# Altium schematic sheet SoC_pwr_1.SchDoc
size A1; PageSetup: Record=PageOptions|CenterHorizontal=True|CenterVertical=True|PrintScale=0.50|XCorrection=1.00|YCorrection=1.00|PrintKind=1|BorderSize=5000000|LeftOffset=0|BottomOffset=0|Orientation=2|PaperLength=1000|PaperWidth=1000|Scale=100|PaperSource=7|PrintQuality=-3|MediaType=1|DitherType=10|PrintScaleMode=1|PaperKind=A3|PaperIndex=8
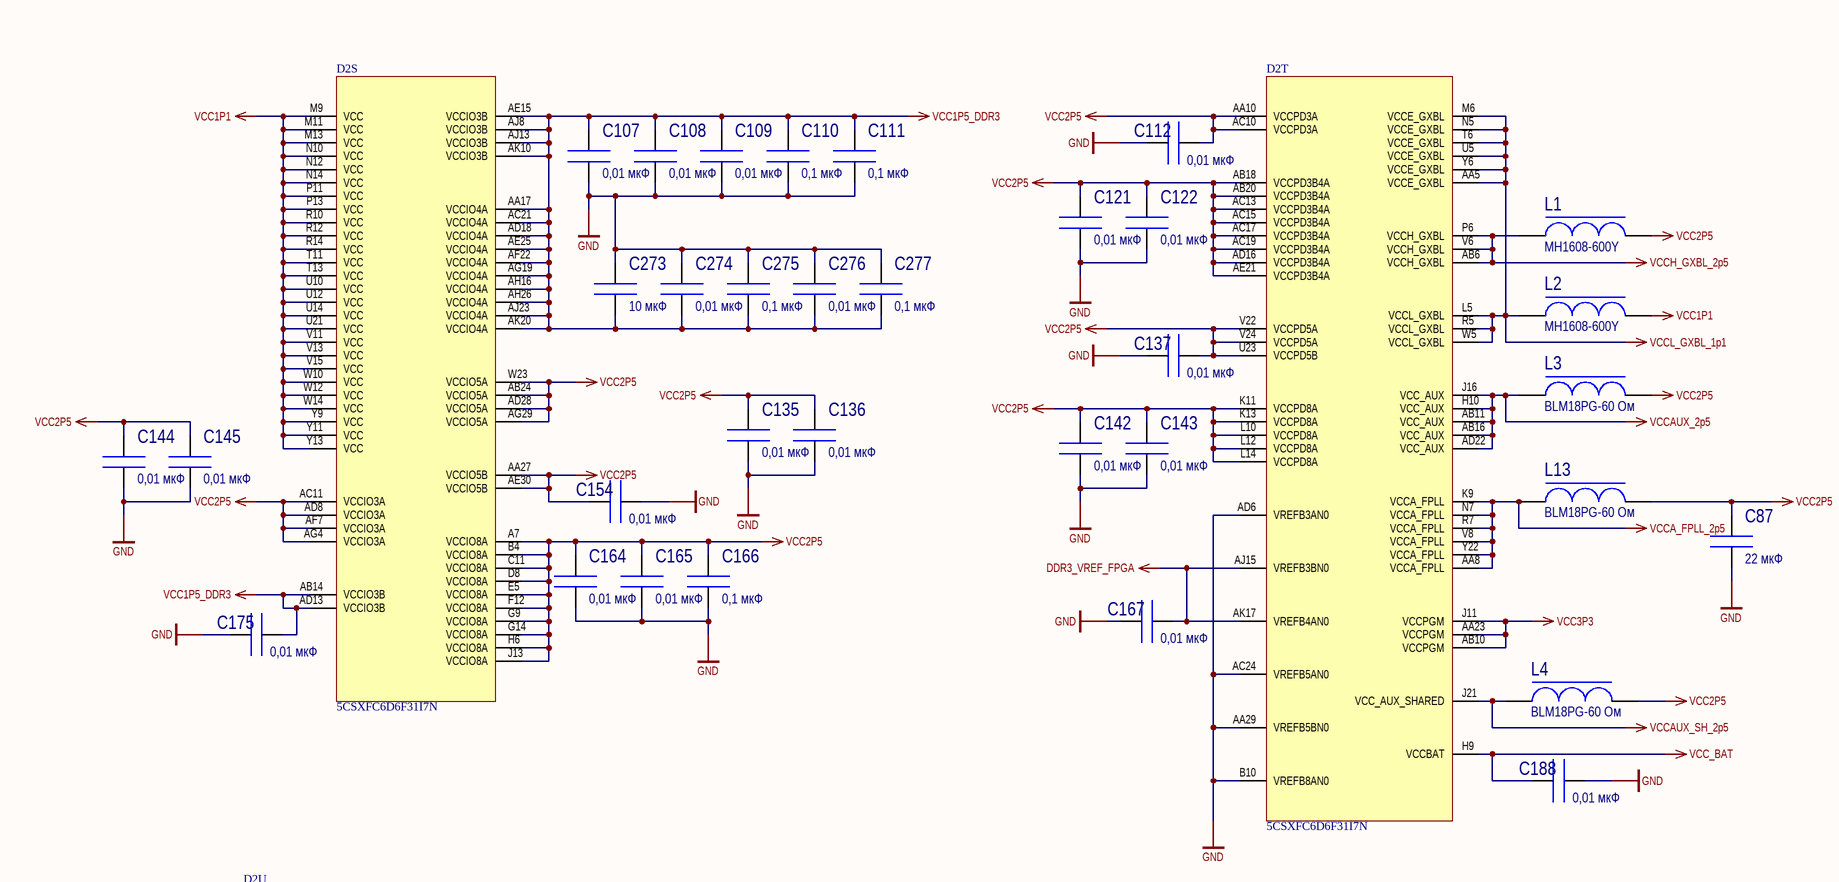
[diagram p0: SoC_pwr_1.SchDoc, top left]
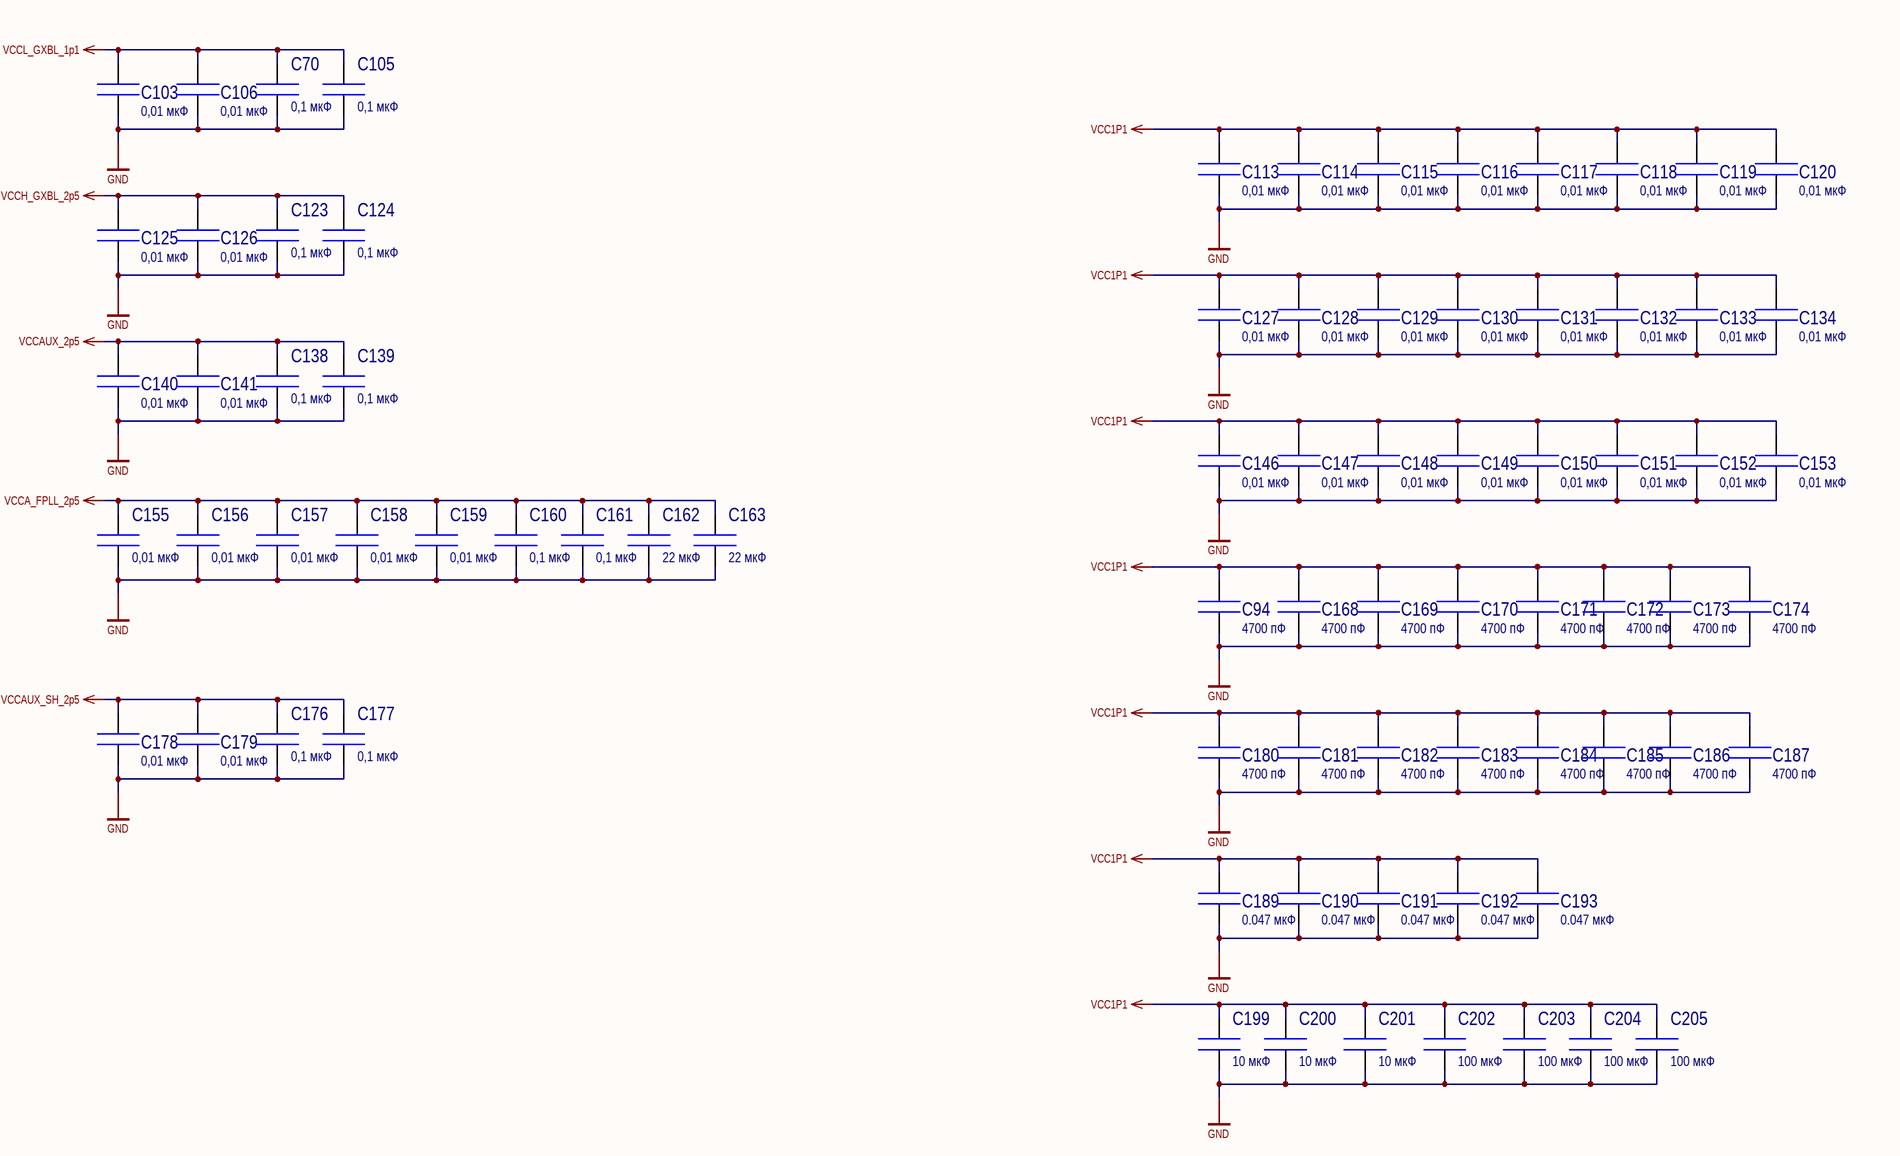
[diagram p1: SoC_pwr_1.SchDoc, top right]
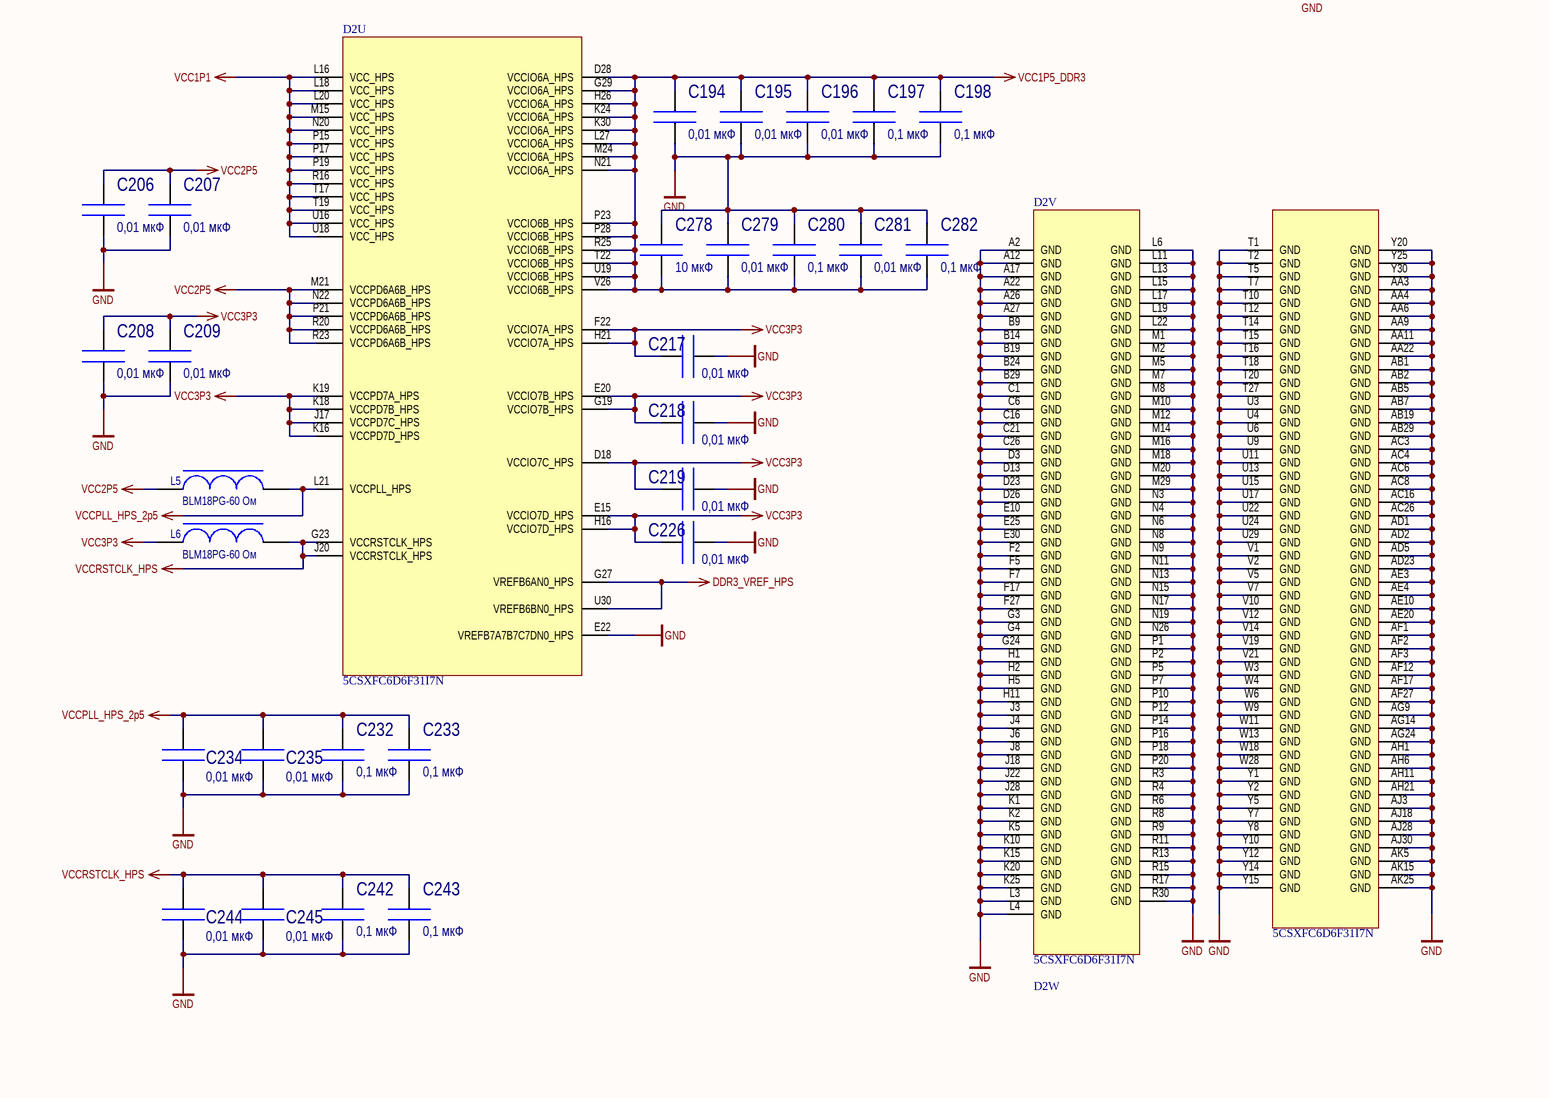
[diagram p2: SoC_pwr_1.SchDoc, bottom left]
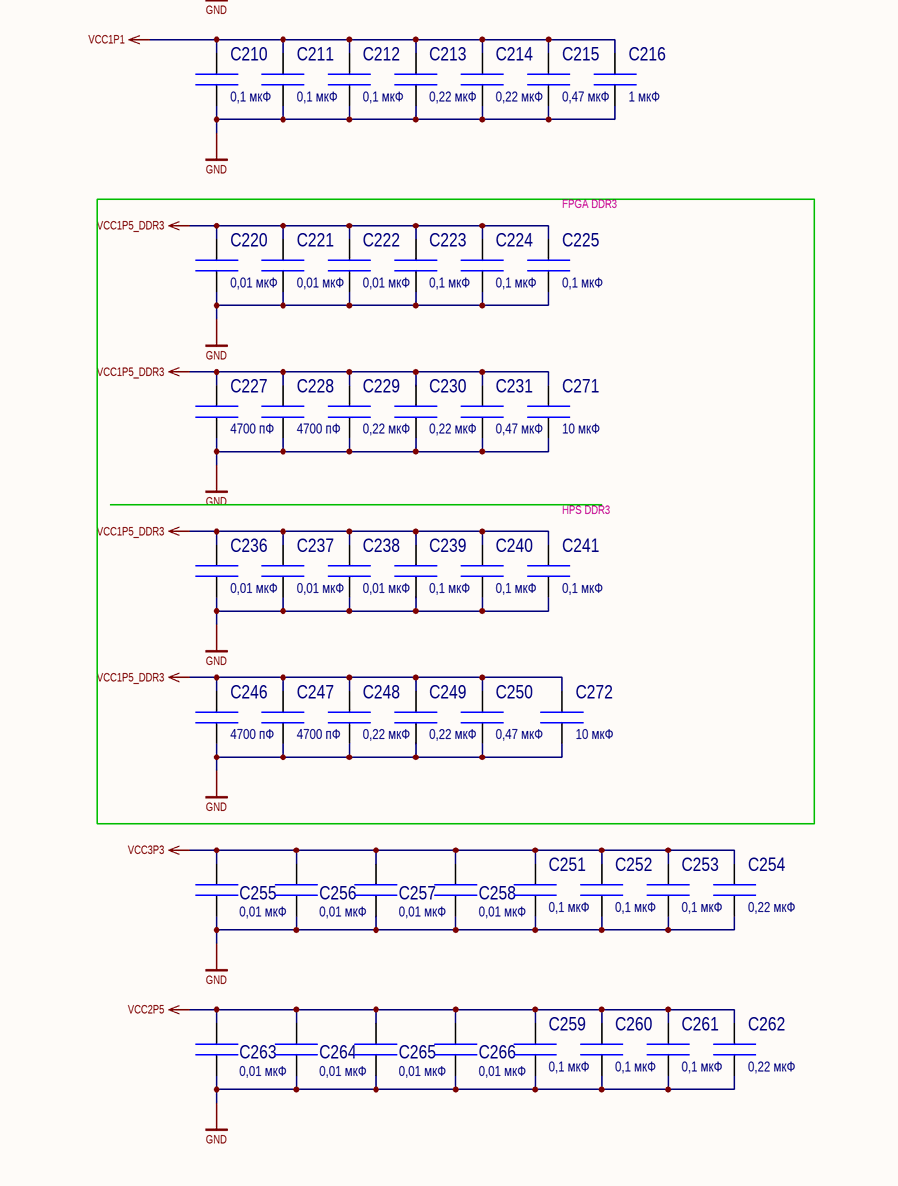
[diagram p3: SoC_pwr_1.SchDoc, bottom right]

## Parts
C70  value 0,1 мкФ  [CC0402(1005)]  (hidden comment: CC0402-X7R-0,1 мкФ-20%-10В)
C87  value 22 мкФ  [CC0603]  (hidden comment: CC0603-X5R-22 мкФ-20%-6,3В)
C94  value 4700 пФ  [CC0402(1005)]  (hidden comment: CC0402-X7R-4700 пФ-10%-50В)
C103  value 0,01 мкФ  [CC0402(1005)]  (hidden comment: CC0402-X7R-0,01 мкФ-10%-50В)
C105  value 0,1 мкФ  [CC0402(1005)]  (hidden comment: CC0402-X7R-0,1 мкФ-20%-10В)
C106  value 0,01 мкФ  [CC0402(1005)]  (hidden comment: CC0402-X7R-0,01 мкФ-10%-50В)
C107  value 0,01 мкФ  [CC0402(1005)]  (hidden comment: CC0402-X7R-0,01 мкФ-10%-50В)
C108  value 0,01 мкФ  [CC0402(1005)]  (hidden comment: CC0402-X7R-0,01 мкФ-10%-50В)
C109  value 0,01 мкФ  [CC0402(1005)]  (hidden comment: CC0402-X7R-0,01 мкФ-10%-50В)
C110  value 0,1 мкФ  [CC0402(1005)]  (hidden comment: CC0402-X7R-0,1 мкФ-20%-10В)
C111  value 0,1 мкФ  [CC0402(1005)]  (hidden comment: CC0402-X7R-0,1 мкФ-20%-10В)
C112  value 0,01 мкФ  [CC0402(1005)]  (hidden comment: CC0402-X7R-0,01 мкФ-10%-50В)
C113  value 0,01 мкФ  [CC0402(1005)]  (hidden comment: CC0402-X7R-0,01 мкФ-10%-50В)
C114  value 0,01 мкФ  [CC0402(1005)]  (hidden comment: CC0402-X7R-0,01 мкФ-10%-50В)
C115  value 0,01 мкФ  [CC0402(1005)]  (hidden comment: CC0402-X7R-0,01 мкФ-10%-50В)
C116  value 0,01 мкФ  [CC0402(1005)]  (hidden comment: CC0402-X7R-0,01 мкФ-10%-50В)
C117  value 0,01 мкФ  [CC0402(1005)]  (hidden comment: CC0402-X7R-0,01 мкФ-10%-50В)
C118  value 0,01 мкФ  [CC0402(1005)]  (hidden comment: CC0402-X7R-0,01 мкФ-10%-50В)
C119  value 0,01 мкФ  [CC0402(1005)]  (hidden comment: CC0402-X7R-0,01 мкФ-10%-50В)
C120  value 0,01 мкФ  [CC0402(1005)]  (hidden comment: CC0402-X7R-0,01 мкФ-10%-50В)
C121  value 0,01 мкФ  [CC0402(1005)]  (hidden comment: CC0402-X7R-0,01 мкФ-10%-50В)
C122  value 0,01 мкФ  [CC0402(1005)]  (hidden comment: CC0402-X7R-0,01 мкФ-10%-50В)
C123  value 0,1 мкФ  [CC0402(1005)]  (hidden comment: CC0402-X7R-0,1 мкФ-20%-10В)
C124  value 0,1 мкФ  [CC0402(1005)]  (hidden comment: CC0402-X7R-0,1 мкФ-20%-10В)
C125  value 0,01 мкФ  [CC0402(1005)]  (hidden comment: CC0402-X7R-0,01 мкФ-10%-50В)
C126  value 0,01 мкФ  [CC0402(1005)]  (hidden comment: CC0402-X7R-0,01 мкФ-10%-50В)
C127  value 0,01 мкФ  [CC0402(1005)]  (hidden comment: CC0402-X7R-0,01 мкФ-10%-50В)
C128  value 0,01 мкФ  [CC0402(1005)]  (hidden comment: CC0402-X7R-0,01 мкФ-10%-50В)
C129  value 0,01 мкФ  [CC0402(1005)]  (hidden comment: CC0402-X7R-0,01 мкФ-10%-50В)
C130  value 0,01 мкФ  [CC0402(1005)]  (hidden comment: CC0402-X7R-0,01 мкФ-10%-50В)
C131  value 0,01 мкФ  [CC0402(1005)]  (hidden comment: CC0402-X7R-0,01 мкФ-10%-50В)
C132  value 0,01 мкФ  [CC0402(1005)]  (hidden comment: CC0402-X7R-0,01 мкФ-10%-50В)
C133  value 0,01 мкФ  [CC0402(1005)]  (hidden comment: CC0402-X7R-0,01 мкФ-10%-50В)
C134  value 0,01 мкФ  [CC0402(1005)]  (hidden comment: CC0402-X7R-0,01 мкФ-10%-50В)
C135  value 0,01 мкФ  [CC0402(1005)]  (hidden comment: CC0402-X7R-0,01 мкФ-10%-50В)
C136  value 0,01 мкФ  [CC0402(1005)]  (hidden comment: CC0402-X7R-0,01 мкФ-10%-50В)
C137  value 0,01 мкФ  [CC0402(1005)]  (hidden comment: CC0402-X7R-0,01 мкФ-10%-50В)
C138  value 0,1 мкФ  [CC0402(1005)]  (hidden comment: CC0402-X7R-0,1 мкФ-20%-10В)
C139  value 0,1 мкФ  [CC0402(1005)]  (hidden comment: CC0402-X7R-0,1 мкФ-20%-10В)
C140  value 0,01 мкФ  [CC0402(1005)]  (hidden comment: CC0402-X7R-0,01 мкФ-10%-50В)
C141  value 0,01 мкФ  [CC0402(1005)]  (hidden comment: CC0402-X7R-0,01 мкФ-10%-50В)
C142  value 0,01 мкФ  [CC0402(1005)]  (hidden comment: CC0402-X7R-0,01 мкФ-10%-50В)
C143  value 0,01 мкФ  [CC0402(1005)]  (hidden comment: CC0402-X7R-0,01 мкФ-10%-50В)
C144  value 0,01 мкФ  [CC0402(1005)]  (hidden comment: CC0402-X7R-0,01 мкФ-10%-50В)
C145  value 0,01 мкФ  [CC0402(1005)]  (hidden comment: CC0402-X7R-0,01 мкФ-10%-50В)
C146  value 0,01 мкФ  [CC0402(1005)]  (hidden comment: CC0402-X7R-0,01 мкФ-10%-50В)
C147  value 0,01 мкФ  [CC0402(1005)]  (hidden comment: CC0402-X7R-0,01 мкФ-10%-50В)
C148  value 0,01 мкФ  [CC0402(1005)]  (hidden comment: CC0402-X7R-0,01 мкФ-10%-50В)
C149  value 0,01 мкФ  [CC0402(1005)]  (hidden comment: CC0402-X7R-0,01 мкФ-10%-50В)
C150  value 0,01 мкФ  [CC0402(1005)]  (hidden comment: CC0402-X7R-0,01 мкФ-10%-50В)
C151  value 0,01 мкФ  [CC0402(1005)]  (hidden comment: CC0402-X7R-0,01 мкФ-10%-50В)
C152  value 0,01 мкФ  [CC0402(1005)]  (hidden comment: CC0402-X7R-0,01 мкФ-10%-50В)
C153  value 0,01 мкФ  [CC0402(1005)]  (hidden comment: CC0402-X7R-0,01 мкФ-10%-50В)
C154  value 0,01 мкФ  [CC0402(1005)]  (hidden comment: CC0402-X7R-0,01 мкФ-10%-50В)
C155  value 0,01 мкФ  [CC0402(1005)]  (hidden comment: CC0402-X7R-0,01 мкФ-10%-50В)
C156  value 0,01 мкФ  [CC0402(1005)]  (hidden comment: CC0402-X7R-0,01 мкФ-10%-50В)
C157  value 0,01 мкФ  [CC0402(1005)]  (hidden comment: CC0402-X7R-0,01 мкФ-10%-50В)
C158  value 0,01 мкФ  [CC0402(1005)]  (hidden comment: CC0402-X7R-0,01 мкФ-10%-50В)
C159  value 0,01 мкФ  [CC0402(1005)]  (hidden comment: CC0402-X7R-0,01 мкФ-10%-50В)
C160  value 0,1 мкФ  [CC0402(1005)]  (hidden comment: CC0402-X7R-0,1 мкФ-20%-10В)
C161  value 0,1 мкФ  [CC0402(1005)]  (hidden comment: CC0402-X7R-0,1 мкФ-20%-10В)
C162  value 22 мкФ  [CC0603]  (hidden comment: CC0603-X5R-22 мкФ-20%-6,3В)
C163  value 22 мкФ  [CC0603]  (hidden comment: CC0603-X5R-22 мкФ-20%-6,3В)
C164  value 0,01 мкФ  [CC0402(1005)]  (hidden comment: CC0402-X7R-0,01 мкФ-10%-50В)
C165  value 0,01 мкФ  [CC0402(1005)]  (hidden comment: CC0402-X7R-0,01 мкФ-10%-50В)
C166  value 0,1 мкФ  [CC0402(1005)]  (hidden comment: CC0402-X7R-0,1 мкФ-20%-10В)
C167  value 0,01 мкФ  [CC0402(1005)]  (hidden comment: CC0402-X7R-0,01 мкФ-10%-50В)
C168  value 4700 пФ  [CC0402(1005)]  (hidden comment: CC0402-X7R-4700 пФ-10%-50В)
C169  value 4700 пФ  [CC0402(1005)]  (hidden comment: CC0402-X7R-4700 пФ-10%-50В)
C170  value 4700 пФ  [CC0402(1005)]  (hidden comment: CC0402-X7R-4700 пФ-10%-50В)
C171  value 4700 пФ  [CC0402(1005)]  (hidden comment: CC0402-X7R-4700 пФ-10%-50В)
C172  value 4700 пФ  [CC0402(1005)]  (hidden comment: CC0402-X7R-4700 пФ-10%-50В)
C173  value 4700 пФ  [CC0402(1005)]  (hidden comment: CC0402-X7R-4700 пФ-10%-50В)
C174  value 4700 пФ  [CC0402(1005)]  (hidden comment: CC0402-X7R-4700 пФ-10%-50В)
C175  value 0,01 мкФ  [CC0402(1005)]  (hidden comment: CC0402-X7R-0,01 мкФ-10%-50В)
C176  value 0,1 мкФ  [CC0402(1005)]  (hidden comment: CC0402-X7R-0,1 мкФ-20%-10В)
C177  value 0,1 мкФ  [CC0402(1005)]  (hidden comment: CC0402-X7R-0,1 мкФ-20%-10В)
C178  value 0,01 мкФ  [CC0402(1005)]  (hidden comment: CC0402-X7R-0,01 мкФ-10%-50В)
C179  value 0,01 мкФ  [CC0402(1005)]  (hidden comment: CC0402-X7R-0,01 мкФ-10%-50В)
C180  value 4700 пФ  [CC0402(1005)]  (hidden comment: CC0402-X7R-4700 пФ-10%-50В)
C181  value 4700 пФ  [CC0402(1005)]  (hidden comment: CC0402-X7R-4700 пФ-10%-50В)
C182  value 4700 пФ  [CC0402(1005)]  (hidden comment: CC0402-X7R-4700 пФ-10%-50В)
C183  value 4700 пФ  [CC0402(1005)]  (hidden comment: CC0402-X7R-4700 пФ-10%-50В)
C184  value 4700 пФ  [CC0402(1005)]  (hidden comment: CC0402-X7R-4700 пФ-10%-50В)
C185  value 4700 пФ  [CC0402(1005)]  (hidden comment: CC0402-X7R-4700 пФ-10%-50В)
C186  value 4700 пФ  [CC0402(1005)]  (hidden comment: CC0402-X7R-4700 пФ-10%-50В)
C187  value 4700 пФ  [CC0402(1005)]  (hidden comment: CC0402-X7R-4700 пФ-10%-50В)
C188  value 0,01 мкФ  [CC0402(1005)]  (hidden comment: CC0402-X7R-0,01 мкФ-10%-50В)
C189  value 0.047 мкФ  [CC0402(1005)]  (hidden comment: CC0402-X7R-0.047 мкФ-10%-50В)
C190  value 0.047 мкФ  [CC0402(1005)]  (hidden comment: CC0402-X7R-0.047 мкФ-10%-50В)
C191  value 0.047 мкФ  [CC0402(1005)]  (hidden comment: CC0402-X7R-0.047 мкФ-10%-50В)
C192  value 0.047 мкФ  [CC0402(1005)]  (hidden comment: CC0402-X7R-0.047 мкФ-10%-50В)
C193  value 0.047 мкФ  [CC0402(1005)]  (hidden comment: CC0402-X7R-0.047 мкФ-10%-50В)
C194  value 0,01 мкФ  [CC0402(1005)]  (hidden comment: CC0402-X7R-0,01 мкФ-10%-50В)
C195  value 0,01 мкФ  [CC0402(1005)]  (hidden comment: CC0402-X7R-0,01 мкФ-10%-50В)
C196  value 0,01 мкФ  [CC0402(1005)]  (hidden comment: CC0402-X7R-0,01 мкФ-10%-50В)
C197  value 0,1 мкФ  [CC0402(1005)]  (hidden comment: CC0402-X7R-0,1 мкФ-20%-10В)
C198  value 0,1 мкФ  [CC0402(1005)]  (hidden comment: CC0402-X7R-0,1 мкФ-20%-10В)
C199  value 10 мкФ  [CC0402(1005)]  (hidden comment: CC0402-X5R-10 мкФ-20%-6.3В)
C200  value 10 мкФ  [CC0402(1005)]  (hidden comment: CC0402-X5R-10 мкФ-20%-6.3В)
C201  value 10 мкФ  [CC0402(1005)]  (hidden comment: CC0402-X5R-10 мкФ-20%-6.3В)
C202  value 100 мкФ  [CC0805]  (hidden comment: CC0805-X5R-100 мкФ-20%-4В)
C203  value 100 мкФ  [CC0805]  (hidden comment: CC0805-X5R-100 мкФ-20%-4В)
C204  value 100 мкФ  [CC0805]  (hidden comment: CC0805-X5R-100 мкФ-20%-4В)
C205  value 100 мкФ  [CC0805]  (hidden comment: CC0805-X5R-100 мкФ-20%-4В)
C206  value 0,01 мкФ  [CC0402(1005)]  (hidden comment: CC0402-X7R-0,01 мкФ-10%-50В)
C207  value 0,01 мкФ  [CC0402(1005)]  (hidden comment: CC0402-X7R-0,01 мкФ-10%-50В)
C208  value 0,01 мкФ  [CC0402(1005)]  (hidden comment: CC0402-X7R-0,01 мкФ-10%-50В)
C209  value 0,01 мкФ  [CC0402(1005)]  (hidden comment: CC0402-X7R-0,01 мкФ-10%-50В)
C210  value 0,1 мкФ  [CC0402(1005)]  (hidden comment: CC0402-X7R-0,1 мкФ-20%-10В)
C211  value 0,1 мкФ  [CC0402(1005)]  (hidden comment: CC0402-X7R-0,1 мкФ-20%-10В)
C212  value 0,1 мкФ  [CC0402(1005)]  (hidden comment: CC0402-X7R-0,1 мкФ-20%-10В)
C213  value 0,22 мкФ  [CC0402(1005)]  (hidden comment: CC0402-X7R-0,22 мкФ-10%-6.3В)
C214  value 0,22 мкФ  [CC0402(1005)]  (hidden comment: CC0402-X7R-0,22 мкФ-10%-6.3В)
C215  value 0,47 мкФ  [CC0402(1005)]  (hidden comment: CC0402-X7R-0,47 мкФ-10%-6.3В)
C216  value 1 мкФ  [CC0402(1005)]  (hidden comment: CC0402-X5R-1 мкФ-10%-6.3В)
C217  value 0,01 мкФ  [CC0402(1005)]  (hidden comment: CC0402-X7R-0,01 мкФ-10%-50В)
C218  value 0,01 мкФ  [CC0402(1005)]  (hidden comment: CC0402-X7R-0,01 мкФ-10%-50В)
C219  value 0,01 мкФ  [CC0402(1005)]  (hidden comment: CC0402-X7R-0,01 мкФ-10%-50В)
C220  value 0,01 мкФ  [CC0402(1005)]  (hidden comment: CC0402-X7R-0,01 мкФ-10%-50В)
C221  value 0,01 мкФ  [CC0402(1005)]  (hidden comment: CC0402-X7R-0,01 мкФ-10%-50В)
C222  value 0,01 мкФ  [CC0402(1005)]  (hidden comment: CC0402-X7R-0,01 мкФ-10%-50В)
C223  value 0,1 мкФ  [CC0402(1005)]  (hidden comment: CC0402-X7R-0,1 мкФ-20%-10В)
C224  value 0,1 мкФ  [CC0402(1005)]  (hidden comment: CC0402-X7R-0,1 мкФ-20%-10В)
C225  value 0,1 мкФ  [CC0402(1005)]  (hidden comment: CC0402-X7R-0,1 мкФ-20%-10В)
C226  value 0,01 мкФ  [CC0402(1005)]  (hidden comment: CC0402-X7R-0,01 мкФ-10%-50В)
C227  value 4700 пФ  [CC0402(1005)]  (hidden comment: CC0402-X7R-4700 пФ-10%-50В)
C228  value 4700 пФ  [CC0402(1005)]  (hidden comment: CC0402-X7R-4700 пФ-10%-50В)
C229  value 0,22 мкФ  [CC0402(1005)]  (hidden comment: CC0402-X7R-0,22 мкФ-10%-6.3В)
C230  value 0,22 мкФ  [CC0402(1005)]  (hidden comment: CC0402-X7R-0,22 мкФ-10%-6.3В)
C231  value 0,47 мкФ  [CC0402(1005)]  (hidden comment: CC0402-X7R-0,47 мкФ-10%-6.3В)
C232  value 0,1 мкФ  [CC0402(1005)]  (hidden comment: CC0402-X7R-0,1 мкФ-20%-10В)
C233  value 0,1 мкФ  [CC0402(1005)]  (hidden comment: CC0402-X7R-0,1 мкФ-20%-10В)
C234  value 0,01 мкФ  [CC0402(1005)]  (hidden comment: CC0402-X7R-0,01 мкФ-10%-50В)
C235  value 0,01 мкФ  [CC0402(1005)]  (hidden comment: CC0402-X7R-0,01 мкФ-10%-50В)
C236  value 0,01 мкФ  [CC0402(1005)]  (hidden comment: CC0402-X7R-0,01 мкФ-10%-50В)
C237  value 0,01 мкФ  [CC0402(1005)]  (hidden comment: CC0402-X7R-0,01 мкФ-10%-50В)
C238  value 0,01 мкФ  [CC0402(1005)]  (hidden comment: CC0402-X7R-0,01 мкФ-10%-50В)
C239  value 0,1 мкФ  [CC0402(1005)]  (hidden comment: CC0402-X7R-0,1 мкФ-20%-10В)
C240  value 0,1 мкФ  [CC0402(1005)]  (hidden comment: CC0402-X7R-0,1 мкФ-20%-10В)
C241  value 0,1 мкФ  [CC0402(1005)]  (hidden comment: CC0402-X7R-0,1 мкФ-20%-10В)
C242  value 0,1 мкФ  [CC0402(1005)]  (hidden comment: CC0402-X7R-0,1 мкФ-20%-10В)
C243  value 0,1 мкФ  [CC0402(1005)]  (hidden comment: CC0402-X7R-0,1 мкФ-20%-10В)
C244  value 0,01 мкФ  [CC0402(1005)]  (hidden comment: CC0402-X7R-0,01 мкФ-10%-50В)
C245  value 0,01 мкФ  [CC0402(1005)]  (hidden comment: CC0402-X7R-0,01 мкФ-10%-50В)
C246  value 4700 пФ  [CC0402(1005)]  (hidden comment: CC0402-X7R-4700 пФ-10%-50В)
C247  value 4700 пФ  [CC0402(1005)]  (hidden comment: CC0402-X7R-4700 пФ-10%-50В)
C248  value 0,22 мкФ  [CC0402(1005)]  (hidden comment: CC0402-X7R-0,22 мкФ-10%-6.3В)
C249  value 0,22 мкФ  [CC0402(1005)]  (hidden comment: CC0402-X7R-0,22 мкФ-10%-6.3В)
C250  value 0,47 мкФ  [CC0402(1005)]  (hidden comment: CC0402-X7R-0,47 мкФ-10%-6.3В)
C251  value 0,1 мкФ  [CC0402(1005)]  (hidden comment: CC0402-X7R-0,1 мкФ-20%-10В)
C252  value 0,1 мкФ  [CC0402(1005)]  (hidden comment: CC0402-X7R-0,1 мкФ-20%-10В)
C253  value 0,1 мкФ  [CC0402(1005)]  (hidden comment: CC0402-X7R-0,1 мкФ-20%-10В)
C254  value 0,22 мкФ  [CC0402(1005)]  (hidden comment: CC0402-X7R-0,22 мкФ-10%-6.3В)
C255  value 0,01 мкФ  [CC0402(1005)]  (hidden comment: CC0402-X7R-0,01 мкФ-10%-50В)
C256  value 0,01 мкФ  [CC0402(1005)]  (hidden comment: CC0402-X7R-0,01 мкФ-10%-50В)
C257  value 0,01 мкФ  [CC0402(1005)]  (hidden comment: CC0402-X7R-0,01 мкФ-10%-50В)
C258  value 0,01 мкФ  [CC0402(1005)]  (hidden comment: CC0402-X7R-0,01 мкФ-10%-50В)
C259  value 0,1 мкФ  [CC0402(1005)]  (hidden comment: CC0402-X7R-0,1 мкФ-20%-10В)
C260  value 0,1 мкФ  [CC0402(1005)]  (hidden comment: CC0402-X7R-0,1 мкФ-20%-10В)
C261  value 0,1 мкФ  [CC0402(1005)]  (hidden comment: CC0402-X7R-0,1 мкФ-20%-10В)
C262  value 0,22 мкФ  [CC0402(1005)]  (hidden comment: CC0402-X7R-0,22 мкФ-10%-6.3В)
C263  value 0,01 мкФ  [CC0402(1005)]  (hidden comment: CC0402-X7R-0,01 мкФ-10%-50В)
C264  value 0,01 мкФ  [CC0402(1005)]  (hidden comment: CC0402-X7R-0,01 мкФ-10%-50В)
C265  value 0,01 мкФ  [CC0402(1005)]  (hidden comment: CC0402-X7R-0,01 мкФ-10%-50В)
C266  value 0,01 мкФ  [CC0402(1005)]  (hidden comment: CC0402-X7R-0,01 мкФ-10%-50В)
C271  value 10 мкФ  [CC0402(1005)]  (hidden comment: CC0402-X5R-10 мкФ-20%-6.3В)
C272  value 10 мкФ  [CC0402(1005)]  (hidden comment: CC0402-X5R-10 мкФ-20%-6.3В)
C273  value 10 мкФ  [CC0402(1005)]  (hidden comment: CC0402-X5R-10 мкФ-20%-6.3В)
C274  value 0,01 мкФ  [CC0402(1005)]  (hidden comment: CC0402-X7R-0,01 мкФ-10%-50В)
C275  value 0,1 мкФ  [CC0402(1005)]  (hidden comment: CC0402-X7R-0,1 мкФ-20%-10В)
C276  value 0,01 мкФ  [CC0402(1005)]  (hidden comment: CC0402-X7R-0,01 мкФ-10%-50В)
C277  value 0,1 мкФ  [CC0402(1005)]  (hidden comment: CC0402-X7R-0,1 мкФ-20%-10В)
C278  value 10 мкФ  [CC0402(1005)]  (hidden comment: CC0402-X5R-10 мкФ-20%-6.3В)
C279  value 0,01 мкФ  [CC0402(1005)]  (hidden comment: CC0402-X7R-0,01 мкФ-10%-50В)
C280  value 0,1 мкФ  [CC0402(1005)]  (hidden comment: CC0402-X7R-0,1 мкФ-20%-10В)
C281  value 0,01 мкФ  [CC0402(1005)]  (hidden comment: CC0402-X7R-0,01 мкФ-10%-50В)
C282  value 0,1 мкФ  [CC0402(1005)]  (hidden comment: CC0402-X7R-0,1 мкФ-20%-10В)
D2  5CSXFC6D6F31I7N  [ALTR-FBGA896_A-200]  (parts S,T,U,V,W of 24)
L1  MH1608-600Y  [CL0805]
L2  MH1608-600Y  [CL0805]
L3  BLM18PG-60 Ом  [CL0603]
L4  BLM18PG-60 Ом  [CL0603]
L5  BLM18PG-60 Ом  [CL0603]
L6  BLM18PG-60 Ом  [CL0603]
L13  BLM18PG-60 Ом  [CL0603]

## Nets
DDR3_VREF_FPGA: C167.1(+) D2.AJ15(VREFB3BN0) D2.AK17(VREFB4AN0)
DDR3_VREF_HPS: D2.G27(VREFB6AN0_HPS) D2.U30(VREFB6BN0_HPS)
GND: C70.1(+) C87.2(-) C94.2(-) C103.1(+) C105.1(+) C106.1(+) C107.1(+) C108.1(+) C109.1(+) C110.1(+) C111.1(+) C112.2(-) C113.1(+) C114.1(+) C115.1(+) C116.1(+) C117.1(+) C118.1(+) C119.1(+) C120.1(+) C121.1(+) C122.1(+) C123.1(+) C124.1(+) C125.1(+) C126.1(+) C127.1(+) C128.1(+) C129.1(+) C130.1(+) C131.1(+) C132.1(+) C133.1(+) C134.1(+) C135.1(+) C136.1(+) C137.2(-) C138.1(+) C139.1(+) C140.1(+) C141.1(+) C142.1(+) C143.1(+) C144.1(+) C145.1(+) C146.1(+) C147.1(+) C148.1(+) C149.1(+) C150.1(+) C151.1(+) C152.1(+) C153.1(+) C154.2(-) C155.1(+) C156.1(+) C157.1(+) C158.1(+) C159.1(+) C160.1(+) C161.1(+) C162.2(-) C163.2(-) C164.1(+) C165.1(+) C166.1(+) C167.2(-) C168.2(-) C169.2(-) C170.2(-) C171.2(-) C172.2(-) C173.2(-) C174.2(-) C175.2(-) C176.1(+) C177.1(+) C178.1(+) C179.1(+) C180.2(-) C181.2(-) C182.2(-) C183.2(-) C184.2(-) C185.2(-) C186.2(-) C187.2(-) C188.2(-) C189.2(-) C190.2(-) C191.2(-) C192.2(-) C193.2(-) C194.1(+) C195.1(+) C196.1(+) C197.1(+) C198.1(+) C199.1(+) C200.1(+) C201.1(+) C202.2(-) C203.2(-) C204.2(-) C205.2(-) C206.1(+) C207.1(+) C208.1(+) C209.1(+) C210.1(+) C211.1(+) C212.1(+) C213.1(+) C214.1(+) C215.1(+) C216.1(+) C217.1(+) C218.1(+) C219.1(+) C220.1(+) C221.1(+) C222.1(+) C223.1(+) C224.1(+) C225.1(+) C226.1(+) C227.2(-) C228.2(-) C229.1(+) C230.1(+) C231.1(+) C232.1(+) C233.1(+) C234.1(+) C235.1(+) C236.1(+) C237.1(+) C238.1(+) C239.1(+) C240.1(+) C241.1(+) C242.1(+) C243.1(+) C244.1(+) C245.1(+) C246.2(-) C247.2(-) C248.1(+) C249.1(+) C250.1(+) C251.1(+) C252.1(+) C253.1(+) C254.1(+) C255.1(+) C256.1(+) C257.1(+) C258.1(+) C259.1(+) C260.1(+) C261.1(+) C262.1(+) C263.1(+) C264.1(+) C265.1(+) C266.1(+) C271.1(+) C272.1(+) C273.2(-) C274.2(-) C275.2(-) C276.2(-) C277.2(-) C278.2(-) C279.2(-) C280.2(-) C281.2(-) C282.2(-) D2.A2(GND) D2.A12(GND) D2.A17(GND) D2.A22(GND) D2.A26(GND) D2.A27(GND) D2.AA3(GND) D2.AA4(GND) D2.AA6(GND) D2.AA9(GND) D2.AA11(GND) D2.AA22(GND) D2.AA29(VREFB5BN0) D2.AB1(GND) D2.AB2(GND) D2.AB5(GND) D2.AB7(GND) D2.AB19(GND) D2.AB29(GND) D2.AC3(GND) D2.AC4(GND) D2.AC6(GND) D2.AC8(GND) D2.AC16(GND) D2.AC24(VREFB5AN0) D2.AC26(GND) D2.AD1(GND) D2.AD2(GND) D2.AD5(GND) D2.AD6(VREFB3AN0) D2.AD23(GND) D2.AE3(GND) D2.AE4(GND) D2.AE10(GND) D2.AE20(GND) D2.AF1(GND) D2.AF2(GND) D2.AF3(GND) D2.AF12(GND) D2.AF17(GND) D2.AF27(GND) D2.AG9(GND) D2.AG14(GND) D2.AG24(GND) D2.AH1(GND) D2.AH6(GND) D2.AH11(GND) D2.AH21(GND) D2.AJ3(GND) D2.AJ18(GND) D2.AJ28(GND) D2.AJ30(GND) D2.AK5(GND) D2.AK15(GND) D2.AK25(GND) D2.B9(GND) D2.B10(VREFB8AN0) D2.B14(GND) D2.B19(GND) D2.B24(GND) D2.B29(GND) D2.C1(GND) D2.C6(GND) D2.C16(GND) D2.C21(GND) D2.C26(GND) D2.D3(GND) D2.D13(GND) D2.D23(GND) D2.D26(GND) D2.E10(GND) D2.E22(VREFB7A7B7C7DN0_HPS) D2.E25(GND) D2.E30(GND) D2.F2(GND) D2.F5(GND) D2.F7(GND) D2.F17(GND) D2.F27(GND) D2.G3(GND) D2.G4(GND) D2.G24(GND) D2.H1(GND) D2.H2(GND) D2.H5(GND) D2.H11(GND) D2.J3(GND) D2.J4(GND) D2.J6(GND) D2.J8(GND) D2.J18(GND) D2.J22(GND) D2.J28(GND) D2.K1(GND) D2.K2(GND) D2.K5(GND) D2.K10(GND) D2.K15(GND) D2.K20(GND) D2.K25(GND) D2.L3(GND) D2.L4(GND) D2.L6(GND) D2.L11(GND) D2.L13(GND) D2.L15(GND) D2.L17(GND) D2.L19(GND) D2.L22(GND) D2.M1(GND) D2.M2(GND) D2.M5(GND) D2.M7(GND) D2.M8(GND) D2.M10(GND) D2.M12(GND) D2.M14(GND) D2.M16(GND) D2.M18(GND) D2.M20(GND) D2.M29(GND) D2.N3(GND) D2.N4(GND) D2.N6(GND) D2.N8(GND) D2.N9(GND) D2.N11(GND) D2.N13(GND) D2.N15(GND) D2.N17(GND) D2.N19(GND) D2.N26(GND) D2.P1(GND) D2.P2(GND) D2.P5(GND) D2.P7(GND) D2.P10(GND) D2.P12(GND) D2.P14(GND) D2.P16(GND) D2.P18(GND) D2.P20(GND) D2.R3(GND) D2.R4(GND) D2.R6(GND) D2.R8(GND) D2.R9(GND) D2.R11(GND) D2.R13(GND) D2.R15(GND) D2.R17(GND) D2.R30(GND) D2.T1(GND) D2.T2(GND) D2.T5(GND) D2.T7(GND) D2.T10(GND) D2.T12(GND) D2.T14(GND) D2.T15(GND) D2.T16(GND) D2.T18(GND) D2.T20(GND) D2.T27(GND) D2.U3(GND) D2.U4(GND) D2.U6(GND) D2.U9(GND) D2.U11(GND) D2.U13(GND) D2.U15(GND) D2.U17(GND) D2.U22(GND) D2.U24(GND) D2.U29(GND) D2.V1(GND) D2.V2(GND) D2.V5(GND) D2.V7(GND) D2.V10(GND) D2.V12(GND) D2.V14(GND) D2.V19(GND) D2.V21(GND) D2.W3(GND) D2.W4(GND) D2.W6(GND) D2.W9(GND) D2.W11(GND) D2.W13(GND) D2.W18(GND) D2.W28(GND) D2.Y1(GND) D2.Y2(GND) D2.Y5(GND) D2.Y7(GND) D2.Y8(GND) D2.Y10(GND) D2.Y12(GND) D2.Y14(GND) D2.Y15(GND) D2.Y20(GND) D2.Y25(GND) D2.Y30(GND)
VCC1P1: C94.1(+) C113.2(-) C114.2(-) C115.2(-) C116.2(-) C117.2(-) C118.2(-) C119.2(-) C120.2(-) C127.2(-) C128.2(-) C129.2(-) C130.2(-) C131.2(-) C132.2(-) C133.2(-) C134.2(-) C146.2(-) C147.2(-) C148.2(-) C149.2(-) C150.2(-) C151.2(-) C152.2(-) C153.2(-) C168.1(+) C169.1(+) C170.1(+) C171.1(+) C172.1(+) C173.1(+) C174.1(+) C180.1(+) C181.1(+) C182.1(+) C183.1(+) C184.1(+) C185.1(+) C186.1(+) C187.1(+) C189.1(+) C190.1(+) C191.1(+) C192.1(+) C193.1(+) C199.2(-) C200.2(-) C201.2(-) C202.1(+) C203.1(+) C204.1(+) C205.1(+) C210.2(-) C211.2(-) C212.2(-) C213.2(-) C214.2(-) C215.2(-) C216.2(-) D2.L16(VCC_HPS) D2.L18(VCC_HPS) D2.L20(VCC_HPS) D2.M9(VCC) D2.M11(VCC) D2.M13(VCC) D2.M15(VCC_HPS) D2.N10(VCC) D2.N12(VCC) D2.N14(VCC) D2.N20(VCC_HPS) D2.P11(VCC) D2.P13(VCC) D2.P15(VCC_HPS) D2.P17(VCC_HPS) D2.P19(VCC_HPS) D2.R10(VCC) D2.R12(VCC) D2.R14(VCC) D2.R16(VCC_HPS) D2.T11(VCC) D2.T13(VCC) D2.T17(VCC_HPS) D2.T19(VCC_HPS) D2.U10(VCC) D2.U12(VCC) D2.U14(VCC) D2.U16(VCC_HPS) D2.U18(VCC_HPS) D2.U21(VCC) D2.V11(VCC) D2.V13(VCC) D2.V15(VCC) D2.W10(VCC) D2.W12(VCC) D2.W14(VCC) D2.Y9(VCC) D2.Y11(VCC) D2.Y13(VCC) L2.2
VCC1P5_DDR3: C107.2(-) C108.2(-) C109.2(-) C110.2(-) C111.2(-) C175.1(+) C194.2(-) C195.2(-) C196.2(-) C197.2(-) C198.2(-) C220.2(-) C221.2(-) C222.2(-) C223.2(-) C224.2(-) C225.2(-) C227.1(+) C228.1(+) C229.2(-) C230.2(-) C231.2(-) C236.2(-) C237.2(-) C238.2(-) C239.2(-) C240.2(-) C241.2(-) C246.1(+) C247.1(+) C248.2(-) C249.2(-) C250.2(-) C271.2(-) C272.2(-) C273.1(+) C274.1(+) C275.1(+) C276.1(+) C277.1(+) C278.1(+) C279.1(+) C280.1(+) C281.1(+) C282.1(+) D2.AA17(VCCIO4A) D2.AB14(VCCIO3B) D2.AC21(VCCIO4A) D2.AD13(VCCIO3B) D2.AD18(VCCIO4A) D2.AE15(VCCIO3B) D2.AE25(VCCIO4A) D2.AF22(VCCIO4A) D2.AG19(VCCIO4A) D2.AH16(VCCIO4A) D2.AH26(VCCIO4A) D2.AJ8(VCCIO3B) D2.AJ13(VCCIO3B) D2.AJ23(VCCIO4A) D2.AK10(VCCIO3B) D2.AK20(VCCIO4A) D2.D28(VCCIO6A_HPS) D2.G29(VCCIO6A_HPS) D2.H26(VCCIO6A_HPS) D2.K24(VCCIO6A_HPS) D2.K30(VCCIO6A_HPS) D2.L27(VCCIO6A_HPS) D2.M24(VCCIO6A_HPS) D2.N21(VCCIO6A_HPS) D2.P23(VCCIO6B_HPS) D2.P28(VCCIO6B_HPS) D2.R25(VCCIO6B_HPS) D2.T22(VCCIO6B_HPS) D2.U19(VCCIO6B_HPS) D2.V26(VCCIO6B_HPS)
VCC2P5: C87.1(+) C112.1(+) C121.2(-) C122.2(-) C135.2(-) C136.2(-) C137.1(+) C142.2(-) C143.2(-) C144.2(-) C145.2(-) C154.1(+) C164.2(-) C165.2(-) C166.2(-) C206.2(-) C207.2(-) C259.2(-) C260.2(-) C261.2(-) C262.2(-) C263.2(-) C264.2(-) C265.2(-) C266.2(-) D2.A7(VCCIO8A) D2.AA10(VCCPD3A) D2.AA27(VCCIO5B) D2.AB18(VCCPD3B4A) D2.AB20(VCCPD3B4A) D2.AB24(VCCIO5A) D2.AC10(VCCPD3A) D2.AC11(VCCIO3A) D2.AC13(VCCPD3B4A) D2.AC15(VCCPD3B4A) D2.AC17(VCCPD3B4A) D2.AC19(VCCPD3B4A) D2.AD8(VCCIO3A) D2.AD16(VCCPD3B4A) D2.AD28(VCCIO5A) D2.AE21(VCCPD3B4A) D2.AE30(VCCIO5B) D2.AF7(VCCIO3A) D2.AG4(VCCIO3A) D2.AG29(VCCIO5A) D2.B4(VCCIO8A) D2.C11(VCCIO8A) D2.D8(VCCIO8A) D2.E5(VCCIO8A) D2.F12(VCCIO8A) D2.G9(VCCIO8A) D2.G14(VCCIO8A) D2.H6(VCCIO8A) D2.J13(VCCIO8A) D2.K11(VCCPD8A) D2.K13(VCCPD8A) D2.L10(VCCPD8A) D2.L12(VCCPD8A) D2.L14(VCCPD8A) D2.M21(VCCPD6A6B_HPS) D2.N22(VCCPD6A6B_HPS) D2.P21(VCCPD6A6B_HPS) D2.R20(VCCPD6A6B_HPS) D2.R23(VCCPD6A6B_HPS) D2.U23(VCCPD5B) D2.V22(VCCPD5A) D2.V24(VCCPD5A) D2.W23(VCCIO5A) L1.2 L3.2 L4.2 L5.1 L13.2
VCC3P3: C208.2(-) C209.2(-) C217.2(-) C218.2(-) C219.2(-) C226.2(-) C251.2(-) C252.2(-) C253.2(-) C254.2(-) C255.2(-) C256.2(-) C257.2(-) C258.2(-) D2.AA23(VCCPGM) D2.AB10(VCCPGM) D2.D18(VCCIO7C_HPS) D2.E15(VCCIO7D_HPS) D2.E20(VCCIO7B_HPS) D2.F22(VCCIO7A_HPS) D2.G19(VCCIO7B_HPS) D2.H16(VCCIO7D_HPS) D2.H21(VCCIO7A_HPS) D2.J11(VCCPGM) D2.J17(VCCPD7C_HPS) D2.K16(VCCPD7D_HPS) D2.K18(VCCPD7B_HPS) D2.K19(VCCPD7A_HPS) L6.1
VCC_BAT: C188.1(+) D2.H9(VCCBAT)
VCCA_FPLL_2p5: C155.2(-) C156.2(-) C157.2(-) C158.2(-) C159.2(-) C160.2(-) C161.2(-) C162.1(+) C163.1(+) D2.AA8(VCCA_FPLL) D2.K9(VCCA_FPLL) D2.N7(VCCA_FPLL) D2.R7(VCCA_FPLL) D2.V8(VCCA_FPLL) D2.Y22(VCCA_FPLL) L13.1
VCCAUX_2p5: C138.2(-) C139.2(-) C140.2(-) C141.2(-) D2.AB11(VCC_AUX) D2.AB16(VCC_AUX) D2.AD22(VCC_AUX) D2.H10(VCC_AUX) D2.J16(VCC_AUX) L3.1
VCCAUX_SH_2p5: C176.2(-) C177.2(-) C178.2(-) C179.2(-) D2.J21(VCC_AUX_SHARED) L4.1
VCCH_GXBL_2p5: C123.2(-) C124.2(-) C125.2(-) C126.2(-) D2.AB6(VCCH_GXBL) D2.P6(VCCH_GXBL) D2.V6(VCCH_GXBL) L1.1
VCCL_GXBL_1p1: C70.2(-) C103.2(-) C105.2(-) C106.2(-) D2.AA5(VCCE_GXBL) D2.L5(VCCL_GXBL) D2.M6(VCCE_GXBL) D2.N5(VCCE_GXBL) D2.R5(VCCL_GXBL) D2.T6(VCCE_GXBL) D2.U5(VCCE_GXBL) D2.W5(VCCL_GXBL) D2.Y6(VCCE_GXBL) L2.1
VCCPLL_HPS_2p5: C232.2(-) C233.2(-) C234.2(-) C235.2(-) D2.L21(VCCPLL_HPS) L5.2
VCCRSTCLK_HPS: C242.2(-) C243.2(-) C244.2(-) C245.2(-) D2.G23(VCCRSTCLK_HPS) D2.J20(VCCRSTCLK_HPS) L6.2

## Notes on the sheet
- (near C225) FPGA DDR3
- (near C241) HPS DDR3

## Library data of the parts
C70 C94 C103 C105-C161 C164-C201 C206-C266 C271-C282 = CC0402-X7R-#-20%-10В: Чип конденсатор керамический; Supplier 1: Digi-Key
  C70 C105 C110 C111 C123 C124 C138 C139 C160 C161 C166 C176 C177 C197 C198 C210-C212 C223-C225 C232 C233 C239-C243 C251-C253 C259-C261 C275 C277 C280 C282: Supplier Part Number 1: 399-3520-1-ND
  C94 C168-C174 C180-C187 C227 C228 C246 C247: Supplier Part Number 1: 490-1506-2-ND
  C103 C106-C109 C112-C122 C125-C137 C140-C159 C164 C165 C167 C175 C178 C179 C188 C194-C196 C206-C209 C217-C222 C226 C234-C238 C244 C245 C255-C258 C263-C266 C274 C276 C279 C281: Supplier Part Number 1: 490-4516-2-ND
  C189-C193: Supplier Part Number 1: 490-10702-2-ND
  C199-C201 C271-C273 C278: Supplier Part Number 1: 490-13211-6-ND
  C213 C214 C229 C230 C248 C249 C254 C262: Supplier Part Number 1: 399-4886-2-ND
  C215 C231 C250: Supplier Part Number 1: 399-4899-2-ND
  C216: Supplier Part Number 1: 490-6288-2-ND
C87 C162 C163 = CC0603-X5R-#-20%-6,3В: Чип конденсатор керамический; Vendor: TDK; Vendor P/N: C1608X5R0J226M080AC; Supplier 1: Digi-key; Supplier Part Number 1: 445-8028-2-ND
C202-C205 = CC0805-X7R-#-20%-25В: Чип конденсатор керамический; Компэл: GRM21BR60G107ME15L; Supplier 1: Digi-Key; Supplier Part Number 1: 490-10510-2-ND
D2 = 5CSXFC6D6F31I7N: Cyclone V SX Family FPGA, 1.07 to 1.13 V Supply, 288 I/O Pins, 6 PLLs, 896-Pin FBGA, Speed Grade 7, Industrial Grade, RoHS Compliant; Manufacturer: Altera; Logic Elements (LE) (K): 110; Speed Grade: 7; DatasheetVersion: Rev. 3.4; PackageVersion: Rev. 2.0, 12/2012; PackageReference: FBGA896_A-200; PackageDescription: 896-Pin FineLine Ball-Grid Array (FBGA), Body 31 x 31 mm, Pitch 1 mm; Supplier 1: Digi-Key; Supplier Part Number 1: 5CSXFC6D6F31I7N-ND; Supplier 2: Mouser; Supplier Part Number 2: 989-5CSXFC6D6F31I7N; Device Group: 5CSXFC6; RoHS: RoHS Compliant; Subcategory: Cyclone V SX; Voltage Supply: 1.07 to 1.13 V; NexusDeviceID: 5CSXFC6D6F31I7N; Mounting Technology: Surface Mount; Code_JEDEC: MS-034; PartNumber: 5CSXFC6D6F31I7N; ComponentLink1Description: Manufacturer URL; ComponentLink1URL: http://www.altera.com; ComponentLink2Description: Datasheet; ComponentLink2URL: http://www.altera.com/literature/hb/cyclone-v/cv_51002.pdf; ComponentLink3Description: Package Specification; ComponentLink3URL: http://www.altera.com/devicepackaging/04R00435-01.pdf; ComponentLink4Description: Device Handbook URL; ComponentLink4URL: http://www.altera.com/literature/hb/cyclone-v/cyclone5_handbook.pdf; ComponentLink5Description: Device Pin-Out URL; ComponentLink5URL: http://www.altera.com/literature/dp/cyclone-v/5CSXFC6.xls; ComponentLink6Description: Product URL; ComponentLink6URL: http://www.buyaltera.com/scripts/partsearch.dll?Detail&name=5CSXFC6D6F31I7N-ND
L1 L2 = BLM21: Чип индуктивность подавления EMP
L3-L6 L13 = BLM18: Чип индуктивность подавления EMP; VALUE: 60 Ом; Supplier 1: Digi-Key; Supplier Part Number 1: 490-1036-2-ND